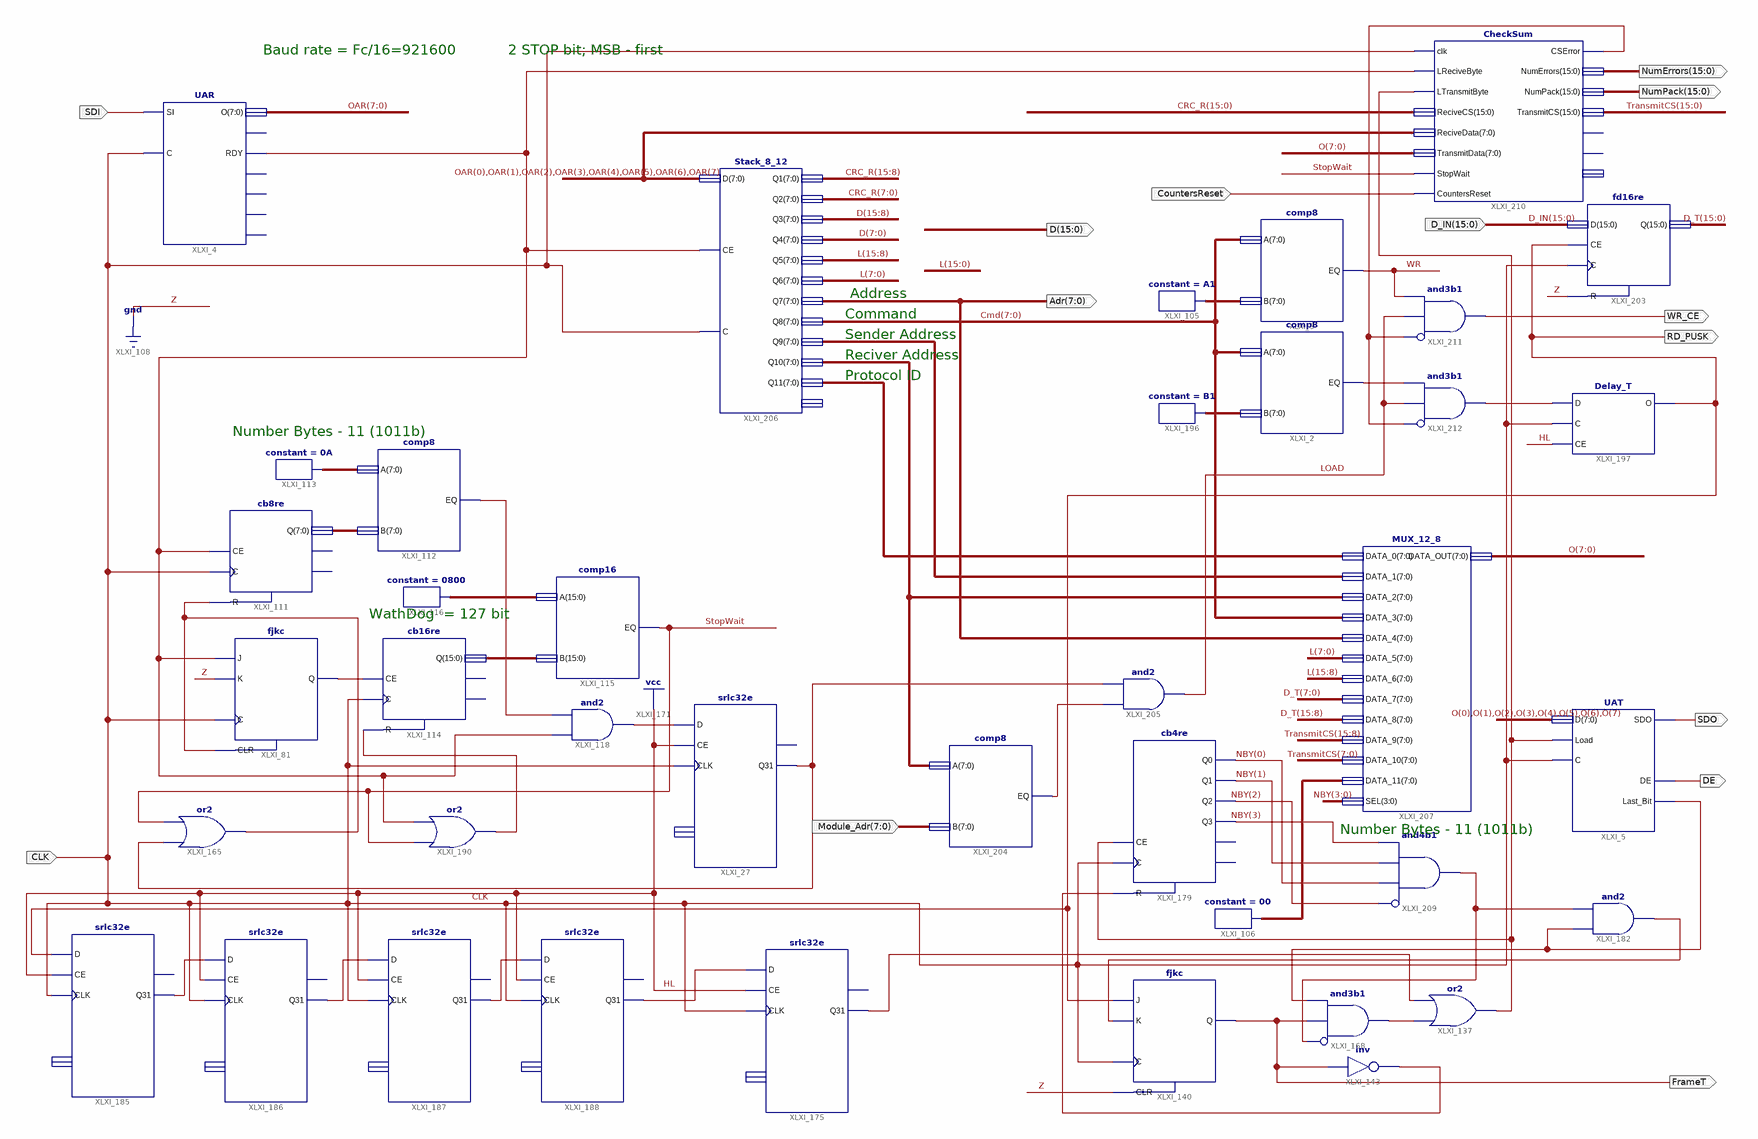
[diagram p0: schematic sheet 1]
// Xilinx ISE schematic COM_port.sch (kintex7) as structural Verilog: 39 symbols, 14 ports
module COM_port (
  input  CLK,
  input  SDI,
  input  [15:0] D_IN,
  input  [7:0] Module_Adr,
  input  CountersReset,
  output [7:0] Adr,
  output FrameT,
  output SDO,
  output DE,
  output RD_PUSK,
  output WR_CE,
  output [15:0] D,
  output [15:0] NumErrors,
  output [15:0] NumPack
);

  wire LOAD, StopWait, WR, XLXN_129, XLXN_187, XLXN_188, XLXN_246, XLXN_248, XLXN_329, XLXN_335, XLXN_403,
       XLXN_405, XLXN_434, XLXN_435, XLXN_436, XLXN_442, XLXN_443, XLXN_447, XLXN_458, XLXN_465, XLXN_475,
       XLXN_501, XLXN_502, XLXN_510, XLXN_515;
  wire [3:0] NBY;
  wire [7:0] Cmd, O, OAR, XLXN_161, XLXN_180, XLXN_181, XLXN_376, XLXN_379, XLXN_467, XLXN_468, XLXN_505;
  wire [15:0] CRC_R, D_T, L, TransmitCS, XLXN_182, XLXN_183;

  UAR XLXI_4 (.C(CLK), .SI(SDI), .RDY(XLXN_501), .O(OAR));  // open: DI, CE_RG, ERR, CE, ODD
  UAT XLXI_5 (
    .D({O[0], O[1], O[2], O[3], O[4], O[5], O[6], O[7]}), .C(CLK), .Load(XLXN_502), .DE(DE), .SDO(SDO),
    .Last_Bit(XLXN_403));
  fjkc XLXI_81 (.C(CLK), .CLR(XLXN_329), .J(XLXN_501), .K(1'b0), .Q(XLXN_129));
  cb8re XLXI_111 (.C(CLK), .CE(XLXN_501), .R(XLXN_329), .Q(XLXN_180));  // open: CEO, TC
  comp8 XLXI_112 (.A(XLXN_181), .B(XLXN_180), .EQ(XLXN_187));
  constant #(.CValue("0A")) XLXI_113 (.O(XLXN_181));
  cb16re XLXI_114 (.C(CLK), .CE(XLXN_129), .R(XLXN_447), .Q(XLXN_182));  // open: CEO, TC
  comp16 XLXI_115 (.A(XLXN_183), .B(XLXN_182), .EQ(StopWait));
  constant #(.CValue("0800")) XLXI_116 (.O(XLXN_183));
  and XLXI_118 (XLXN_188, XLXN_501, XLXN_187);
  or XLXI_137 (XLXN_502, XLXN_335, XLXN_443);
  fjkc XLXI_140 (.C(CLK), .CLR(1'b0), .J(RD_PUSK), .K(XLXN_246), .Q(FrameT));
  not XLXI_143 (XLXN_248, FrameT);
  or XLXI_165 (XLXN_329, XLXN_475, StopWait);
  and XLXI_168 (XLXN_335, ~XLXN_405, FrameT, XLXN_403);  // and3b1
  srlc32e XLXI_175 (.CE(1'b1), .CLK(CLK), .D(XLXN_442), .Q31(XLXN_443));  // open: Q, A
  cb4re XLXI_179 (
    .C(CLK), .CE(XLXN_502), .R(XLXN_248), .Q0(NBY[0]), .Q1(NBY[1]), .Q2(NBY[2]), .Q3(NBY[3]));  // open: CEO, TC
  and XLXI_182 (XLXN_246, XLXN_403, XLXN_405);
  srlc32e XLXI_27 (.CE(1'b1), .CLK(CLK), .D(XLXN_188), .Q31(XLXN_475));  // open: Q, A
  srlc32e XLXI_185 (.CE(1'b1), .CLK(CLK), .D(RD_PUSK), .Q31(XLXN_434));  // open: Q, A
  srlc32e XLXI_186 (.CE(1'b1), .CLK(CLK), .D(XLXN_434), .Q31(XLXN_435));  // open: Q, A
  srlc32e XLXI_187 (.CE(1'b1), .CLK(CLK), .D(XLXN_435), .Q31(XLXN_436));  // open: Q, A
  srlc32e XLXI_188 (.CE(1'b1), .CLK(CLK), .D(XLXN_436), .Q31(XLXN_442));  // open: Q, A
  or XLXI_190 (XLXN_447, StopWait, XLXN_501);
  comp8 XLXI_3 (.A(Cmd), .B(XLXN_161), .EQ(WR));
  comp8 XLXI_2 (.A(Cmd), .B(XLXN_376), .EQ(XLXN_510));
  constant #(.CValue("A1")) XLXI_105 (.O(XLXN_161));
  constant #(.CValue("B1")) XLXI_196 (.O(XLXN_376));
  Delay_T XLXI_197 (.D(XLXN_458), .C(CLK), .CE(1'b1), .O(RD_PUSK));
  comp8 XLXI_204 (.A(XLXN_379), .B(Module_Adr), .EQ(XLXN_465));
  and XLXI_205 (LOAD, XLXN_465, XLXN_475);
  Stack_8_12 XLXI_206 (
    .Q1(CRC_R[15:8]), .Q2(CRC_R[7:0]), .Q3(D[15:8]), .Q4(D[7:0]), .Q5(L[15:8]), .Q6(L[7:0]), .Q7(Adr),
    .Q8(Cmd), .Q9(XLXN_468), .Q10(XLXN_379), .Q11(XLXN_467),
    .D({OAR[0], OAR[1], OAR[2], OAR[3], OAR[4], OAR[5], OAR[6], OAR[7]}), .C(CLK), .CE(XLXN_501));  // open: Q12
  MUX_12_8 XLXI_207 (
    .DATA_0(XLXN_467), .DATA_1(XLXN_468), .DATA_2(XLXN_379), .DATA_3(Cmd), .DATA_4(Adr), .DATA_5(L[7:0]),
    .DATA_6(L[15:8]), .DATA_7(D_T[7:0]), .DATA_8(D_T[15:8]), .DATA_9(TransmitCS[15:8]),
    .DATA_10(TransmitCS[7:0]), .DATA_11(XLXN_505), .SEL(NBY), .DATA_OUT(O));
  and XLXI_209 (XLXN_405, ~NBY[2], NBY[0], NBY[1], NBY[3]);  // and4b1
  constant #(.CValue("00")) XLXI_106 (.O(XLXN_505));
  and XLXI_211 (WR_CE, ~XLXN_515, LOAD, WR);  // and3b1
  and XLXI_212 (XLXN_458, ~XLXN_515, LOAD, XLXN_510);  // and3b1
  fd16re XLXI_203 (.C(CLK), .CE(RD_PUSK), .D(D_IN), .R(1'b0), .Q(D_T));
  CheckSum XLXI_210 (
    .clk(CLK), .LReciveByte(XLXN_501), .LTransmitByte(XLXN_502), .StopWait(StopWait), .ReciveCS(CRC_R),
    .ReciveData({OAR[0], OAR[1], OAR[2], OAR[3], OAR[4], OAR[5], OAR[6], OAR[7]}), .TransmitData(O),
    .CSError(XLXN_515), .NumErrors(NumErrors), .NumPack(NumPack), .TransmitCS(TransmitCS),
    .CountersReset(CountersReset));  // open: TestCRC2, TestCRC3, TestCRC1

  // Notes on the sheet:
  //   Baud rate = Fc/16=921600
  //   2 STOP bit; MSB - first
  //   Address
  //   Command
  //   Sender Address
  //   Reciver Address
  //   Protocol ID
  //   Number Bytes - 11 (1011b)
  //   WathDog  = 127 bit
  //   Number Bytes - 11 (1011b)
endmodule
